# Altium schematic sheet Esark Sign Schematic2.SchDoc
size D; SheetNumber: 1; SheetTotal: 1
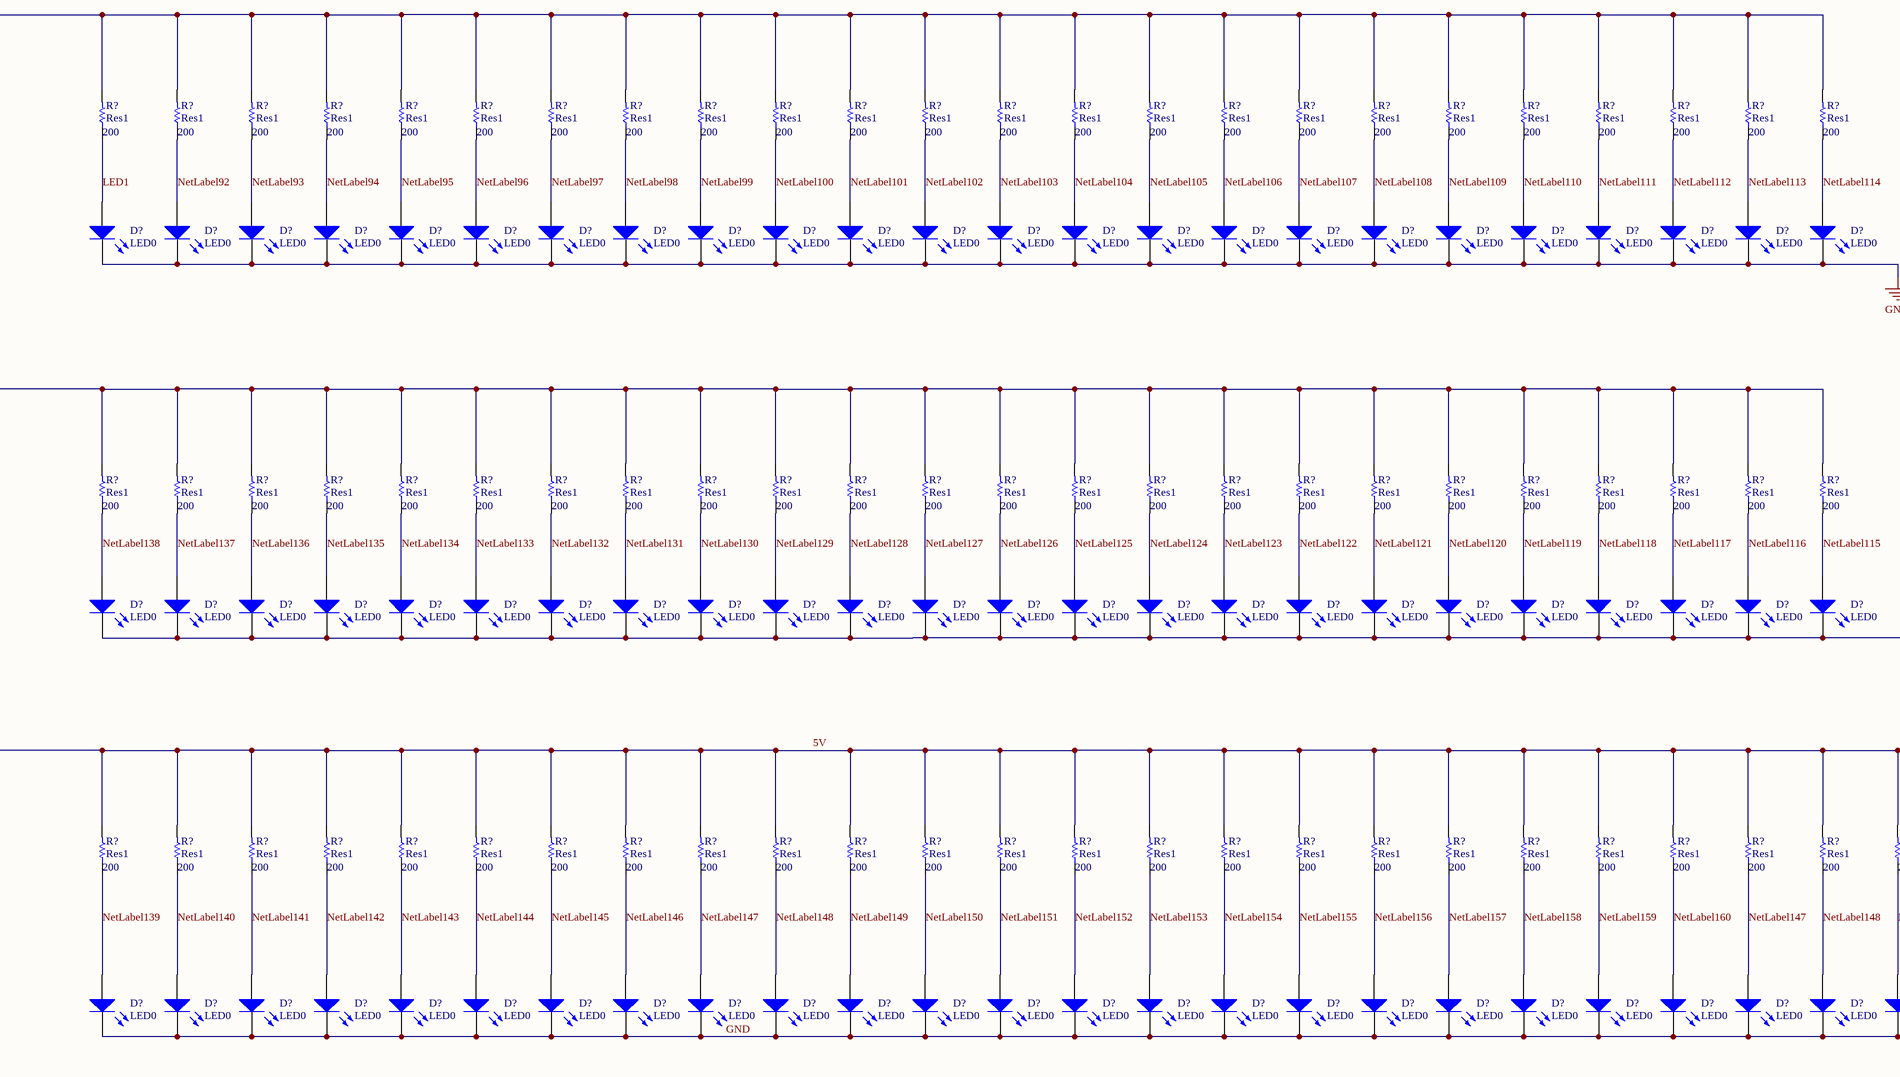
[diagram p0: Esark Sign Schematic2.SchDoc, top left]
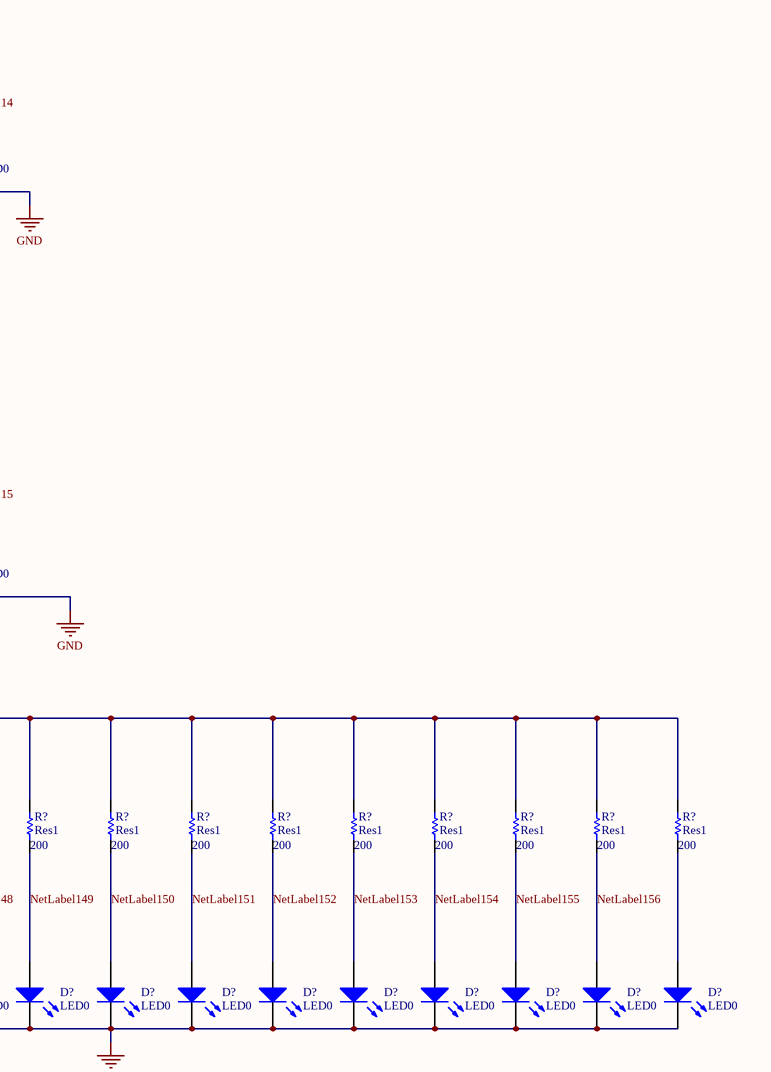
[diagram p1: Esark Sign Schematic2.SchDoc, top right]
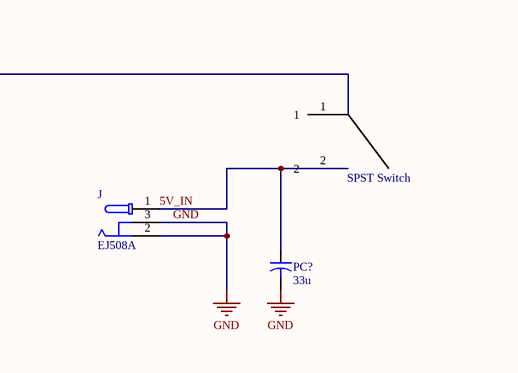
[diagram p2: Esark Sign Schematic2.SchDoc, bottom left]

## Parts
(Parts that share a designator on the sheet are numbered #1, #2 ... from top to bottom, then left to right.)
?  SPST Switch  [SPST Switch]
D?#1  LED0  [LED-0]
D?#2  LED0  [LED-0]
D?#3  LED0  [LED-0]
D?#4  LED0  [LED-0]
D?#5  LED0  [LED-0]
D?#6  LED0  [LED-0]
D?#7  LED0  [LED-0]
D?#8  LED0  [LED-0]
D?#9  LED0  [LED-0]
D?#10  LED0  [LED-0]
D?#11  LED0  [LED-0]
D?#12  LED0  [LED-0]
D?#13  LED0  [LED-0]
D?#14  LED0  [LED-0]
D?#15  LED0  [LED-0]
D?#16  LED0  [LED-0]
D?#17  LED0  [LED-0]
D?#18  LED0  [LED-0]
D?#19  LED0  [LED-0]
D?#20  LED0  [LED-0]
D?#21  LED0  [LED-0]
D?#22  LED0  [LED-0]
D?#23  LED0  [LED-0]
D?#24  LED0  [LED-0]
D?#25  LED0  [LED-0]
D?#26  LED0  [LED-0]
D?#27  LED0  [LED-0]
D?#28  LED0  [LED-0]
D?#29  LED0  [LED-0]
D?#30  LED0  [LED-0]
D?#31  LED0  [LED-0]
D?#32  LED0  [LED-0]
D?#33  LED0  [LED-0]
D?#34  LED0  [LED-0]
D?#35  LED0  [LED-0]
D?#36  LED0  [LED-0]
D?#37  LED0  [LED-0]
D?#38  LED0  [LED-0]
D?#39  LED0  [LED-0]
D?#40  LED0  [LED-0]
D?#41  LED0  [LED-0]
D?#42  LED0  [LED-0]
D?#43  LED0  [LED-0]
D?#44  LED0  [LED-0]
D?#45  LED0  [LED-0]
D?#46  LED0  [LED-0]
D?#47  LED0  [LED-0]
D?#48  LED0  [LED-0]
D?#49  LED0  [LED-0]
D?#50  LED0  [LED-0]
D?#51  LED0  [LED-0]
D?#52  LED0  [LED-0]
D?#53  LED0  [LED-0]
D?#54  LED0  [LED-0]
D?#55  LED0  [LED-0]
D?#56  LED0  [LED-0]
D?#57  LED0  [LED-0]
D?#58  LED0  [LED-0]
D?#59  LED0  [LED-0]
D?#60  LED0  [LED-0]
D?#61  LED0  [LED-0]
D?#62  LED0  [LED-0]
D?#63  LED0  [LED-0]
D?#64  LED0  [LED-0]
D?#65  LED0  [LED-0]
D?#66  LED0  [LED-0]
D?#67  LED0  [LED-0]
D?#68  LED0  [LED-0]
D?#69  LED0  [LED-0]
D?#70  LED0  [LED-0]
D?#71  LED0  [LED-0]
D?#72  LED0  [LED-0]
D?#73  LED0  [LED-0]
D?#74  LED0  [LED-0]
D?#75  LED0  [LED-0]
D?#76  LED0  [LED-0]
D?#77  LED0  [LED-0]
D?#78  LED0  [LED-0]
D?#79  LED0  [LED-0]
D?#80  LED0  [LED-0]
D?#81  LED0  [LED-0]
J  EJ508A  [MPD_EJ508A]
PC?  33u  [CAPR5-4X5]
R?#1  Res1  value 200  [AXIAL-0.3]
R?#2  Res1  value 200  [AXIAL-0.3]
R?#3  Res1  value 200  [AXIAL-0.3]
R?#4  Res1  value 200  [AXIAL-0.3]
R?#5  Res1  value 200  [AXIAL-0.3]
R?#6  Res1  value 200  [AXIAL-0.3]
R?#7  Res1  value 200  [AXIAL-0.3]
R?#8  Res1  value 200  [AXIAL-0.3]
R?#9  Res1  value 200  [AXIAL-0.3]
R?#10  Res1  value 200  [AXIAL-0.3]
R?#11  Res1  value 200  [AXIAL-0.3]
R?#12  Res1  value 200  [AXIAL-0.3]
R?#13  Res1  value 200  [AXIAL-0.3]
R?#14  Res1  value 200  [AXIAL-0.3]
R?#15  Res1  value 200  [AXIAL-0.3]
R?#16  Res1  value 200  [AXIAL-0.3]
R?#17  Res1  value 200  [AXIAL-0.3]
R?#18  Res1  value 200  [AXIAL-0.3]
R?#19  Res1  value 200  [AXIAL-0.3]
R?#20  Res1  value 200  [AXIAL-0.3]
R?#21  Res1  value 200  [AXIAL-0.3]
R?#22  Res1  value 200  [AXIAL-0.3]
R?#23  Res1  value 200  [AXIAL-0.3]
R?#24  Res1  value 200  [AXIAL-0.3]
R?#25  Res1  value 200  [AXIAL-0.3]
R?#26  Res1  value 200  [AXIAL-0.3]
R?#27  Res1  value 200  [AXIAL-0.3]
R?#28  Res1  value 200  [AXIAL-0.3]
R?#29  Res1  value 200  [AXIAL-0.3]
R?#30  Res1  value 200  [AXIAL-0.3]
R?#31  Res1  value 200  [AXIAL-0.3]
R?#32  Res1  value 200  [AXIAL-0.3]
R?#33  Res1  value 200  [AXIAL-0.3]
R?#34  Res1  value 200  [AXIAL-0.3]
R?#35  Res1  value 200  [AXIAL-0.3]
R?#36  Res1  value 200  [AXIAL-0.3]
R?#37  Res1  value 200  [AXIAL-0.3]
R?#38  Res1  value 200  [AXIAL-0.3]
R?#39  Res1  value 200  [AXIAL-0.3]
R?#40  Res1  value 200  [AXIAL-0.3]
R?#41  Res1  value 200  [AXIAL-0.3]
R?#42  Res1  value 200  [AXIAL-0.3]
R?#43  Res1  value 200  [AXIAL-0.3]
R?#44  Res1  value 200  [AXIAL-0.3]
R?#45  Res1  value 200  [AXIAL-0.3]
R?#46  Res1  value 200  [AXIAL-0.3]
R?#47  Res1  value 200  [AXIAL-0.3]
R?#48  Res1  value 200  [AXIAL-0.3]
R?#49  Res1  value 200  [AXIAL-0.3]
R?#50  Res1  value 200  [AXIAL-0.3]
R?#51  Res1  value 200  [AXIAL-0.3]
R?#52  Res1  value 200  [AXIAL-0.3]
R?#53  Res1  value 200  [AXIAL-0.3]
R?#54  Res1  value 200  [AXIAL-0.3]
R?#55  Res1  value 200  [AXIAL-0.3]
R?#56  Res1  value 200  [AXIAL-0.3]
R?#57  Res1  value 200  [AXIAL-0.3]
R?#58  Res1  value 200  [AXIAL-0.3]
R?#59  Res1  value 200  [AXIAL-0.3]
R?#60  Res1  value 200  [AXIAL-0.3]
R?#61  Res1  value 200  [AXIAL-0.3]
R?#62  Res1  value 200  [AXIAL-0.3]
R?#63  Res1  value 200  [AXIAL-0.3]
R?#64  Res1  value 200  [AXIAL-0.3]
R?#65  Res1  value 200  [AXIAL-0.3]
R?#66  Res1  value 200  [AXIAL-0.3]
R?#67  Res1  value 200  [AXIAL-0.3]
R?#68  Res1  value 200  [AXIAL-0.3]
R?#69  Res1  value 200  [AXIAL-0.3]
R?#70  Res1  value 200  [AXIAL-0.3]
R?#71  Res1  value 200  [AXIAL-0.3]
R?#72  Res1  value 200  [AXIAL-0.3]
R?#73  Res1  value 200  [AXIAL-0.3]
R?#74  Res1  value 200  [AXIAL-0.3]
R?#75  Res1  value 200  [AXIAL-0.3]
R?#76  Res1  value 200  [AXIAL-0.3]
R?#77  Res1  value 200  [AXIAL-0.3]
R?#78  Res1  value 200  [AXIAL-0.3]
R?#79  Res1  value 200  [AXIAL-0.3]
R?#80  Res1  value 200  [AXIAL-0.3]
R?#81  Res1  value 200  [AXIAL-0.3]

## Nets
GND: D?#1.2(K) D?#2.2(K) D?#3.2(K) D?#4.2(K) D?#5.2(K) D?#6.2(K) D?#7.2(K) D?#8.2(K) D?#9.2(K) D?#10.2(K) D?#11.2(K) D?#12.2(K) D?#13.2(K) D?#14.2(K) D?#15.2(K) D?#16.2(K) D?#17.2(K) D?#18.2(K) D?#19.2(K) D?#20.2(K) D?#21.2(K) D?#22.2(K) D?#23.2(K) D?#24.2(K) D?#25.2(K) D?#26.2(K) D?#27.2(K) D?#28.2(K) D?#29.2(K) D?#30.2(K) D?#31.2(K) D?#32.2(K) D?#33.2(K) D?#34.2(K) D?#35.2(K) D?#36.2(K) D?#37.2(K) D?#38.2(K) D?#39.2(K) D?#40.2(K) D?#41.2(K) D?#42.2(K) D?#43.2(K) D?#44.2(K) D?#45.2(K) D?#46.2(K) D?#47.2(K) D?#48.2(K) D?#49.2(K) D?#50.2(K) D?#51.2(K) D?#52.2(K) D?#53.2(K) D?#54.2(K) D?#55.2(K) D?#56.2(K) D?#57.2(K) D?#58.2(K) D?#59.2(K) D?#60.2(K) D?#61.2(K) D?#62.2(K) D?#63.2(K) D?#64.2(K) D?#65.2(K) D?#66.2(K) D?#67.2(K) D?#68.2(K) D?#69.2(K) D?#70.2(K) D?#71.2(K) D?#72.2(K) D?#73.2(K) D?#74.2(K) D?#75.2(K) D?#76.2(K) D?#77.2(K) D?#78.2(K) D?#79.2(K) D?#80.2(K) D?#81.2(K) J.2 J.3 PC?.2
5V: ?.1 R?#1.2 R?#2.2 R?#3.2 R?#4.2 R?#5.2 R?#6.2 R?#7.2 R?#8.2 R?#9.2 R?#10.2 R?#11.2 R?#12.2 R?#13.2 R?#14.2 R?#15.2 R?#16.2 R?#17.2 R?#18.2 R?#19.2 R?#20.2 R?#21.2 R?#22.2 R?#23.2 R?#24.2 R?#25.2 R?#26.2 R?#27.2 R?#28.2 R?#29.2 R?#30.2 R?#31.2 R?#32.2 R?#33.2 R?#34.2 R?#35.2 R?#36.2 R?#37.2 R?#38.2 R?#39.2 R?#40.2 R?#41.2 R?#42.2 R?#43.2 R?#44.2 R?#45.2 R?#46.2 R?#47.2 R?#48.2 R?#49.2 R?#50.2 R?#51.2 R?#52.2 R?#53.2 R?#54.2 R?#55.2 R?#56.2 R?#57.2 R?#58.2 R?#59.2 R?#60.2 R?#61.2 R?#62.2 R?#63.2 R?#64.2 R?#65.2 R?#66.2 R?#67.2 R?#68.2 R?#69.2 R?#70.2 R?#71.2 R?#72.2 R?#73.2 R?#74.2 R?#75.2 R?#76.2 R?#77.2 R?#78.2 R?#79.2 R?#80.2 R?#81.2
5V_IN: ?.2 J.1 PC?.1
LED1: D?#1.1(A) R?#1.1
NetLabel92: D?#2.1(A) R?#2.1
NetLabel93: D?#3.1(A) R?#3.1
NetLabel94: D?#4.1(A) R?#4.1
NetLabel95: D?#5.1(A) R?#5.1
NetLabel96: D?#6.1(A) R?#6.1
NetLabel97: D?#7.1(A) R?#7.1
NetLabel98: D?#8.1(A) R?#8.1
NetLabel99: D?#9.1(A) R?#9.1
NetLabel100: D?#10.1(A) R?#10.1
NetLabel101: D?#11.1(A) R?#11.1
NetLabel102: D?#12.1(A) R?#12.1
NetLabel103: D?#13.1(A) R?#13.1
NetLabel104: D?#14.1(A) R?#14.1
NetLabel105: D?#15.1(A) R?#15.1
NetLabel106: D?#16.1(A) R?#16.1
NetLabel107: D?#17.1(A) R?#17.1
NetLabel108: D?#18.1(A) R?#18.1
NetLabel109: D?#19.1(A) R?#19.1
NetLabel110: D?#20.1(A) R?#20.1
NetLabel111: D?#21.1(A) R?#21.1
NetLabel112: D?#22.1(A) R?#22.1
NetLabel113: D?#23.1(A) R?#23.1
NetLabel114: D?#24.1(A) R?#24.1
NetLabel115: D?#48.1(A) R?#48.1
NetLabel116: D?#47.1(A) R?#47.1
NetLabel117: D?#46.1(A) R?#46.1
NetLabel118: D?#45.1(A) R?#45.1
NetLabel119: D?#44.1(A) R?#44.1
NetLabel120: D?#43.1(A) R?#43.1
NetLabel121: D?#42.1(A) R?#42.1
NetLabel122: D?#41.1(A) R?#41.1
NetLabel123: D?#40.1(A) R?#40.1
NetLabel124: D?#39.1(A) R?#39.1
NetLabel125: D?#38.1(A) R?#38.1
NetLabel126: D?#37.1(A) R?#37.1
NetLabel127: D?#36.1(A) R?#36.1
NetLabel128: D?#35.1(A) R?#35.1
NetLabel129: D?#34.1(A) R?#34.1
NetLabel130: D?#33.1(A) R?#33.1
NetLabel131: D?#32.1(A) R?#32.1
NetLabel132: D?#31.1(A) R?#31.1
NetLabel133: D?#30.1(A) R?#30.1
NetLabel134: D?#29.1(A) R?#29.1
NetLabel135: D?#28.1(A) R?#28.1
NetLabel136: D?#27.1(A) R?#27.1
NetLabel137: D?#26.1(A) R?#26.1
NetLabel138: D?#25.1(A) R?#25.1
NetLabel139: D?#49.1(A) R?#49.1
NetLabel140: D?#50.1(A) R?#50.1
NetLabel141: D?#51.1(A) R?#51.1
NetLabel142: D?#52.1(A) R?#52.1
NetLabel143: D?#53.1(A) R?#53.1
NetLabel144: D?#54.1(A) R?#54.1
NetLabel145: D?#55.1(A) R?#55.1
NetLabel146: D?#56.1(A) R?#56.1
NetLabel147: D?#57.1(A) D?#71.1(A) R?#57.1 R?#71.1
NetLabel148: D?#58.1(A) D?#72.1(A) R?#58.1 R?#72.1
NetLabel149: D?#59.1(A) D?#73.1(A) R?#59.1 R?#73.1
NetLabel150: D?#60.1(A) D?#74.1(A) R?#60.1 R?#74.1
NetLabel151: D?#61.1(A) D?#75.1(A) R?#61.1 R?#75.1
NetLabel152: D?#62.1(A) D?#76.1(A) R?#62.1 R?#76.1
NetLabel153: D?#63.1(A) D?#77.1(A) R?#63.1 R?#77.1
NetLabel154: D?#64.1(A) D?#78.1(A) R?#64.1 R?#78.1
NetLabel155: D?#65.1(A) D?#79.1(A) R?#65.1 R?#79.1
NetLabel156: D?#66.1(A) D?#80.1(A) R?#66.1 R?#80.1
NetLabel157: D?#67.1(A) R?#67.1
NetLabel158: D?#68.1(A) R?#68.1
NetLabel159: D?#69.1(A) R?#69.1
NetLabel160: D?#70.1(A) R?#70.1
NetD?#81_1: D?#81.1(A) R?#81.1

## Library data of the parts
D?#1-D?#81 = LED0: Typical INFRARED GaAs LED; Published: 8-Jun-2000; LatestRevisionDate: 08-Jul-2005; LatestRevisionNote: Mech Layer 1 removed.; PackageReference: LED-0; Publisher: Altium Limited; PackageDescription: LED; 2 Leads
J = EJ508A: Power Barrel Connector Jack 2.10mm ID _0.083_, 5.50mm OD _0.217_ Through Hole, Right Angle; MF: MPD; Package: Non-Standard MPD; Value: *; SnapEDA_Link: https://www.snapeda.com/parts/EJ508A/MPD%20%28Memory%20Protection%20Devices%29/view-part/474399/?ref=snap; Price: None; MP: EJ508A; Availability: Unavailable
PC? = Cap2: Capacitor; Published: 23-Sep-2002; PackageReference: CAPR5-4X5; Publisher: Altium Limited; PackageDescription: Capacitor; 2 Leads
R?#1-R?#81 = Res1: Resistor; Published: 8-Jun-2000; LatestRevisionDate: 17-Jul-2002; LatestRevisionNote: Re-released for DXP Platform.; PackageReference: AXIAL-0.3; Publisher: Altium Limited; PackageDescription: Axial Device, Thru-Hole; 2 Leads; 0.3 in Pin Spacing